# EAGLE design m913-dev-adapter (EAGLE 7.5.1)
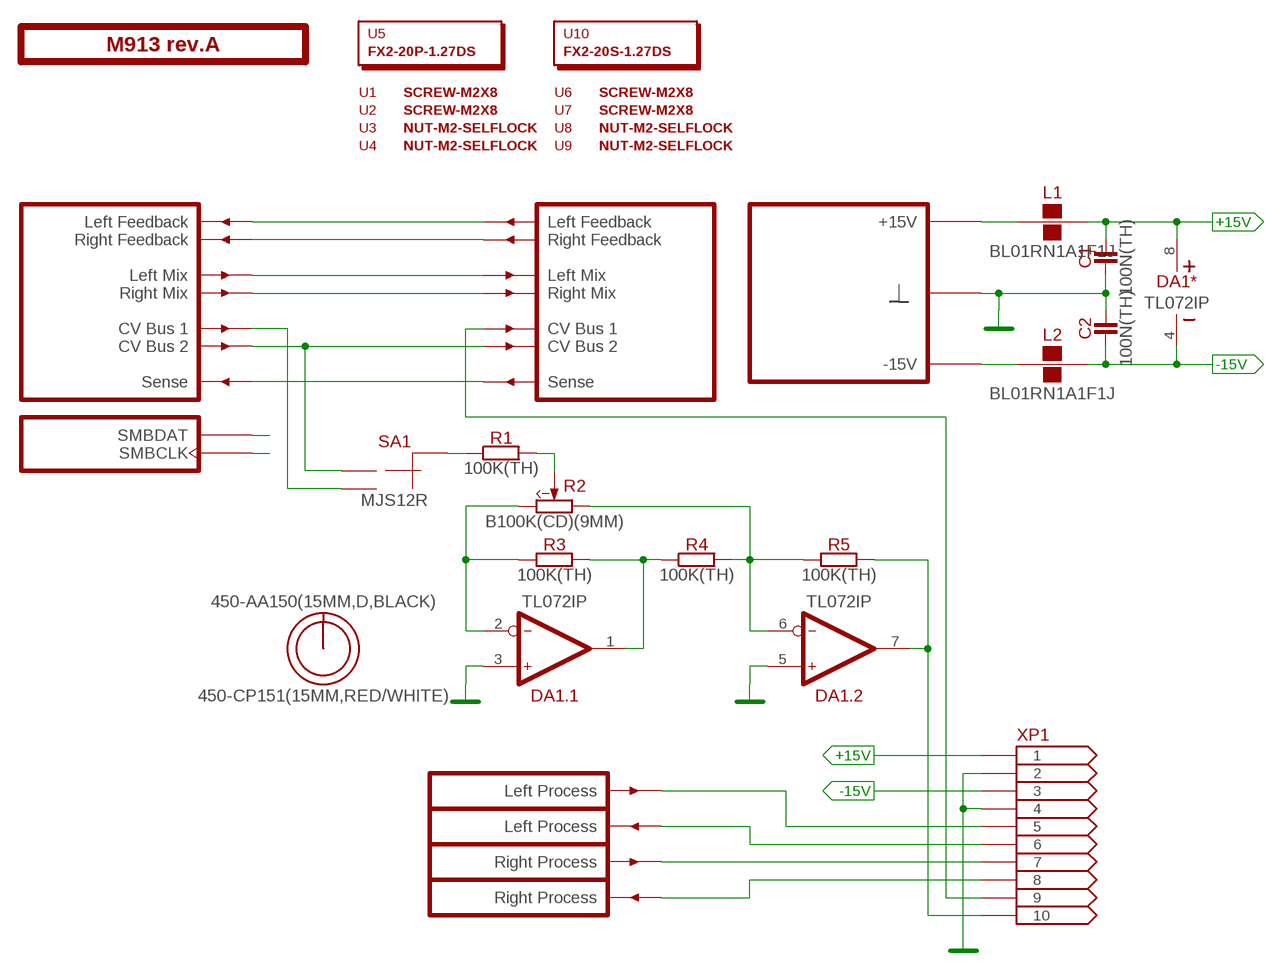
[diagram p0: schematic, sheet 1]

## Parts
C1  100N(TH)  [C050-024X044]
C2  100N(TH)  [C050-024X044]
DA1  TL072IP  [DIP-8]
L1  BL01RN1A1F1J  [BL01RN1A]
L2  BL01RN1A1F1J  [BL01RN1A]
O1  450-AA150(15MM,D,BLACK)  [EMPTY]
O2  450-CP151(15MM,RED/WHITE)  [EMPTY]
PCB1  M913 rev.A  ST2-BOARD-26  [ST2-BOARD-26]
R1  100K(TH)  [R-0207/10]
R2  B100K(CD)(9MM)  [RV09-SINGLE]
R3  100K(TH)  [R-0207/10]
R4  100K(TH)  [R-0207/10]
R5  100K(TH)  [R-0207/10]
SA1  MJS12R  [APEM-MJS12R]
U1  SCREW-M2X8  [EMPTY]
U2  SCREW-M2X8  [EMPTY]
U3  NUT-M2-SELFLOCK  [EMPTY]
U4  NUT-M2-SELFLOCK  [EMPTY]
U5  FX2-20P-1.27DS  [EMPTY]
U6  SCREW-M2X8  [EMPTY]
U7  SCREW-M2X8  [EMPTY]
U8  NUT-M2-SELFLOCK  [EMPTY]
U9  NUT-M2-SELFLOCK  [EMPTY]
U10  FX2-20S-1.27DS  [EMPTY]
XP1  CONN-10-IDC  [ML10]

## Nets
+15V: C1.2 DA1.8(*:V+) L1.2 XP1.1
-15V: C2.1 DA1.4(*:V-) L2.2 XP1.3
GND: C1.1 C2.2 DA1.3(.1:IN+) DA1.5(.2:IN+) PCB1.B4'(GND) PCB1.B4(GND) PCB1.B5'(GND) PCB1.B5(GND) PCB1.B6'(GND) PCB1.B6(GND) PCB1.B7'(GND) PCB1.B7(GND) PCB1.B8'(GND) PCB1.B8(GND) XP1.2 XP1.4
LMIX: PCB1.ALMIX'(LMIX') PCB1.ALMIX(LMIX)
N$1: L1.1 PCB1.A+15'(P+15V) PCB1.A+15(P+15V) PCB1.B+15'(P+15V) PCB1.B+15(P+15V)
N$2: PCB1.ALFBK'(LFBK') PCB1.ALFBK(LFBK)
N$3: R1.2 R2.2(W)
N$4: PCB1.ARFBK'(RFBK') PCB1.ARFBK(RFBK)
N$5: DA1.2(.1:IN-) R2.3(CW) R3.1
N$6: DA1.1(.1:OUT) R3.2 R4.1
N$7: DA1.6(.2:IN-) R2.1(CCW) R4.2 R5.1
N$8: DA1.7(.2:OUT) R5.2 XP1.10
N$9: R1.1 SA1.C(CM)
N$10: PCB1.BINL(INL) XP1.5
N$11: PCB1.BOUTL'(OUTL) XP1.6
N$12: PCB1.BINR(INR) XP1.7
N$13: PCB1.BOUTR'(OUTR) XP1.8
N$14: PCB1.ACV1'(CV1') XP1.9
N$15: PCB1.ACV1(CV1) SA1.NO
N$16: PCB1.BSENSE'(SENSE') PCB1.BSENSE(SENSE)
N$25: L2.1 PCB1.A-15'(P-15V) PCB1.A-15(P-15V) PCB1.B-15'(P-15V) PCB1.B-15(P-15V)
N$38: PCB1.ASMBDAT'(SMBDAT) PCB1.ASMBDAT(SMBDAT)
N$42: PCB1.ACV2'(CV2') PCB1.ACV2(CV2) SA1.NC
N$43: PCB1.ASMBCLK'(SMBCLK) PCB1.ASMBCLK(SMBCLK)
RMIX: PCB1.ARMIX'(RMIX') PCB1.ARMIX(RMIX)

## Library data of the parts
C1 C2 = capacitors:?; MOUSER: 81-RCER71H104K0A2H3B
DA1 = ic-ti:TL072; MOUSER: 595-TL072IP
L1 L2 = inductors:BL01RN1A?; MOUSER: 81-BL01RN1A1F1J
O1 = hardware:450-AA?; MOUSER: 450-AA150
O2 = hardware:450-C?
PCB1 = module-footprints:ST2-BOARD-?
R1 R3-R5 = resistors:?; MOUSER: 71-RN55D-F-100K
R2 = potentiometers:?; MOUSER: 652-PTV09A-4225FB104
SA1 = switches:MJS12R; MOUSER: 642-MJS12R
U1-U4 U6-U9 = hardware:*?
U5 = hardware:?; MOUSER: 798-FX2-20P-1.27DS71
U10 = hardware:?; MOUSER: 798-FX2-20S-1.27DS71
XP1 = connectors:CONN-10-?

## Board
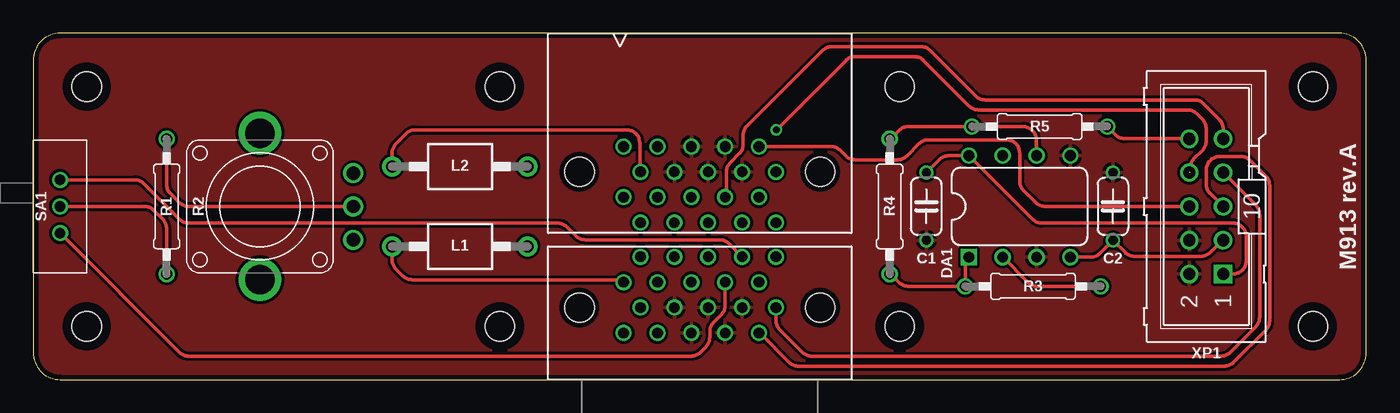
[diagram p1: board, top side]
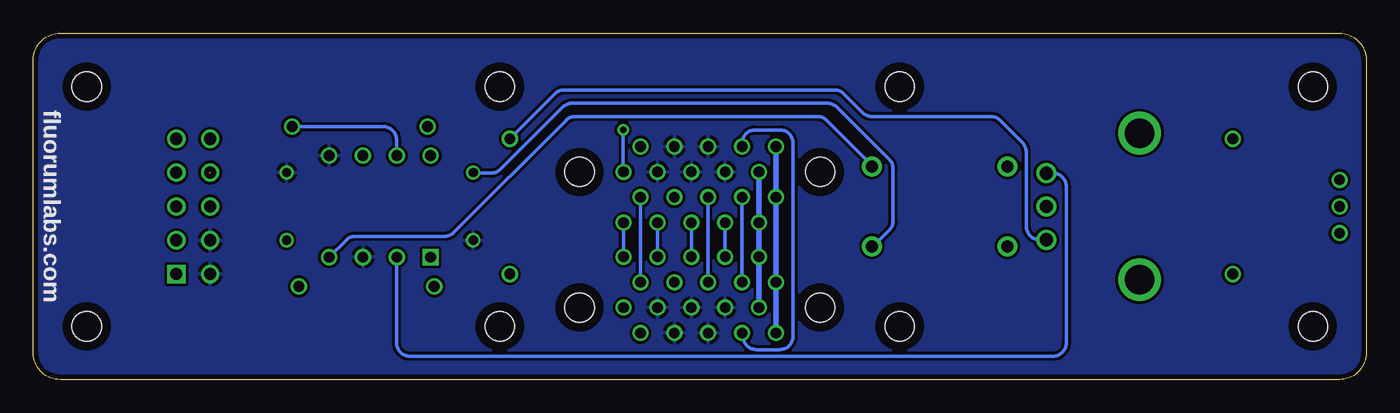
[diagram p2: board, bottom side, seen from below]

Size 100 x 26 mm. Coordinates in mm from the lower left corner, seen from the top.
Outline: 0,24 0,2 arc90 2,0 98,0 arc90 100,2 100,24 arc90 98,26 2,26 arc90 0,24
Copper layers (1*16): Top 0.0356mm / dielectric 1.5011mm / Bottom 0.0356mm
Design rules "sonictrain": minimum track width 6mil, minimum drill 13mil, track to track 8mil, track to pad 8mil, pad to pad 6mil, via to via 6mil, smd to smd 6mil, copper to edge 15mil, drill to drill 6mil, minimum pad ring 7mil, minimum via ring 7mil, stop-mask expansion 3mil, vias tented up to drill 25mil, thermal gap 10mil

### Footprints (pad centres in the part's own frame; a part is rotated, then mirrored left to right if it is on the bottom)
C050-024X044 = drill 0.7: 1 -2.54,0; 2 2.54,0
DIP-8 = drill 0.813 square: 1 -3.81,-3.81 | drill 0.813: 2 -1.27,-3.81; 3 1.27,-3.81; 4 3.81,-3.81; 5 3.81,3.81; 6 1.27,3.81; 7 -1.27,3.81; 8 -3.81,3.81
BL01RN1A = drill 0.9 pad 1.5: 1 -5.08,0; 2 5.08,0
ST2-BOARD-26 = drill 0.8: A+15 44.285,7.31; A+15' 44.285,13.69; A-15 45.555,9.215; A-15' 45.555,11.785; ACV1 51.905,7.31; ACV1' 51.905,13.69; ACV2 53.175,9.215; ACV2' 53.175,11.785; ALFBK 49.365,7.31; ALFBK' 49.365,13.69; ALMIX 46.825,7.31; ALMIX' 46.825,13.69; ARFBK 50.635,9.215; ARFBK' 50.635,11.785; ARMIX 48.095,9.215; ARMIX' 48.095,11.785; ASMBCLK 55.715,9.215; ASMBCLK' 55.715,11.785; ASMBDAT 54.445,7.31; ASMBDAT' 54.445,13.69; B4 48.095,5.405; B4' 48.095,15.595; B5 49.365,3.5; B5' 49.365,17.5; B6 50.635,5.405; B6' 50.635,15.595; B7 51.905,3.5; B7' 51.905,17.5; B8 53.175,5.405; B8' 53.175,15.595; B+15 44.285,3.5; B+15' 44.285,17.5; B-15 45.555,5.405; B-15' 45.555,15.595; BINL 54.445,3.5; BINR 55.715,5.405; BOUTL' 54.445,17.5; BOUTR' 55.715,15.595; BSENSE 46.825,3.5; BSENSE' 46.825,17.5 | hole 2.2: 4,4; 4,22; 96,4; 96,22; 35,22; 65,22; 65,4; 35,4; 59.025,5.405; 40.975,5.405; 40.975,15.595; 59.025,15.595
R-0207/10 = drill 0.813: 1 -5.08,0; 2 5.08,0
RV09-SINGLE = drill 1: 1 -2.5,-7; 2 0,-7; 3 2.5,-7 | drill 2.2: S1 -5.5,0; S2 5.5,0
APEM-MJS12R = drill 0.8: C 0,-2; NC 2,-2; NO -2,-2
ML10 = drill 0.914 square: 1 -5.08,-1.27 | drill 0.914: 2 -5.08,1.27; 3 -2.54,-1.27; 4 -2.54,1.27; 5 0,-1.27; 6 0,1.27; 7 2.54,-1.27; 8 2.54,1.27; 9 5.08,-1.27; 10 5.08,1.27

### Placement (x,y rotation side)
C1  67,13 90 top
C2  81,13 90 top
DA1  74,13 0 top
L1  32,10 0 top
L2  32,16 0 top
O1  -8,-59.25 0 top  (outside the outline)
O2  -9,-60.5 0 top  (outside the outline)
PCB1  0,0 0 top
R1  10,13 90 top
R2  17,13 90 top
R3  75,7 180 top
R4  64.25,13 90 top
R5  75.5,19 0 top
SA1  0,13 90 top
U1  34,-58 0 top  (outside the outline)
U2  37,-58 0 top  (outside the outline)
U3  46,-58 0 top  (outside the outline)
U4  49,-58 0 top  (outside the outline)
U5  28,-58 0 top  (outside the outline)
U6  40,-58 0 top  (outside the outline)
U7  43,-58 0 top  (outside the outline)
U8  52,-58 0 top  (outside the outline)
U9  55,-58 0 top  (outside the outline)
U10  31,-58 0 top  (outside the outline)
XP1  88,13 90 top

### Tracks (layer width: path | path; a pad name or v marks a point on that pad's centre or on a via)
+15V
  Top 0.254: C1.2 67.98,16.52 arc-45 68.68,16.81 DA1.8 74.96,12.04 arc45 75.66,11.75 90,11.75 arc-90 91,10.75 91,8.92 arc-90 90,7.92 XP1.1
  Bottom 0.254: L1.2 37,10 35.79,11.21 arc-45 35.5,11.91 35.5,15.84 arc-45 35.79,16.54 39.71,20.46 arc-45 40.41,20.75 59.59,20.75 arc-45 60.29,20.46 64.96,15.79 arc45 65.66,15.5 66.96,15.5 C1.2
-15V
  Top 0.254: DA1.4 79.32,9.19 arc45 80.02,9.48 C2.1 81.92,9.54 arc45 82.62,9.25 87.59,9.25 arc45 88.29,9.54 89.21,10.46 XP1.3
  Bottom 0.254: L2.2 37.08,16.08 40.46,19.46 arc-45 41.16,19.75 59.34,19.75 arc-45 60.04,19.46 68.46,11.04 arc45 69.16,10.75 75.84,10.75 arc-45 76.54,10.46 DA1.4
GND
  pour Top: 0,26 100,26 100,0 0,0
  pour Bottom: 0,26 100,26 100,0 0,0
LMIX
  Bottom 0.254: PCB1.ALMIX PCB1.ALMIX'
N$1
  Top 0.254: L1.1 26.92,8.99 arc45 27.21,8.29 27.71,7.79 arc45 28.41,7.5 44.09,7.5 PCB1.A+15
  Bottom 0.406: PCB1.B+15' PCB1.A+15' PCB1.A+15 PCB1.B+15
N$2
  Bottom 0.254: PCB1.ALFBK PCB1.ALFBK'
N$3
  Top 0.254: R2.2 11.66,13 arc-45 10.96,13.29 10.29,13.96 arc-45 10,14.66 R1.2
N$4
  Bottom 0.254: PCB1.ARFBK PCB1.ARFBK'
N$5
  Top 0.254: R3.1 75.33,7 arc-45 74.63,7.29 DA1.2
  Bottom 0.254: R2.3 23.5,15.5 arc90 22.5,14.5 22.5,2.75 arc90 23.5,1.75 71.75,1.75 arc90 72.75,2.75 72.75,9.17 DA1.2
N$6
  Top 0.254: DA1.1 arc45 69.92,8.54 R3.2 65.66,7 arc-45 64.96,7.29 64.33,7.92 R4.1
N$7
  Top 0.254: DA1.6 75.25,16.83 75.25,18 arc90 74.25,19 R5.1 65.66,19 arc45 64.96,18.71 64.33,18.08 R4.2
  Bottom 0.254: R2.1 24.5,10.5 arc90 25.5,11.5 25.5,17.09 arc-45 25.79,17.79 27.46,19.46 arc-45 28.16,19.75 37.09,19.75 arc45 37.79,20.04 39.21,21.46 arc-45 39.91,21.75 60.17,21.75 arc-45 60.87,21.46 R4.2
N$8
  Top 0.254: XP1.10 81.91,18.08 arc-45 81.21,18.37 R5.2
  Bottom 0.254: R5.2 73.75,19 arc90 72.75,18 72.75,16.83 DA1.7
N$9
  Top 0.254: SA1.C 8.34,13 arc-45 9.04,12.71 9.71,12.04 arc-45 10,11.34 R1.1
N$10
  Top 0.254: XP1.5 89.25,13 88.29,13.96 arc-45 88,14.66 88,15.75 arc-90 89,16.75 90.59,16.75 arc-45 91.29,16.46 92.46,15.29 arc-45 92.75,14.59 92.75,4.41 arc-45 92.46,3.71 90.04,1.29 arc-45 89.34,1 57.41,1 arc-45 56.71,1.29 54.5,3.5 PCB1.BINL
N$11
  Top 0.254: XP1.6 75.91,13 arc-45 75.21,13.29 74.29,14.21 arc-45 74,14.91 74,17 arc90 73,18 67.16,18 arc45 66.46,17.71 65.54,16.79 arc-45 64.84,16.5 61.66,16.5 arc-45 60.96,16.79 60.54,17.21 arc45 59.84,17.5 PCB1.BOUTL'
N$12
  Top 0.254: PCB1.BINR 55.72,4.45 arc45 56.01,3.74 57.71,2.04 arc45 58.41,1.75 89.09,1.75 arc45 89.79,2.04 91.71,3.96 arc45 92,4.66 92,12.4 arc45 91.71,13.1 XP1.7
N$13  (via drill 0.5)  (1 unrouted)
  Top 0.254: v55.75,18.75 60.96,23.96 arc-45 61.66,24.25 66.09,24.25 arc-45 66.79,23.96 70.21,20.54 arc45 70.91,20.25 86.59,20.25 arc-45 87.29,19.96 87.71,19.54 arc-45 88,18.84 88,17.91 arc-45 87.71,17.21 87.08,16.58 arc45 86.79,15.88 86.79,15.54
  Bottom 0.254: v55.75,18.75 55.75,15.63 PCB1.BOUTR'
N$14
  Top 0.254: XP1.9 89.27,18.82 arc45 88.98,19.52 87.79,20.71 arc45 87.09,21 71.41,21 arc-45 70.71,21.29 67.29,24.71 arc45 66.59,25 59.91,25 arc45 59.21,24.71 53.54,19.04 arc45 53.25,18.34 53.25,17.66 arc-45 52.96,16.96 52.29,16.29 arc45 52,15.59 52,13.79 PCB1.ACV1'
N$15
  Top 0.254: PCB1.ACV1 51.91,5.57 arc-45 51.61,4.86 51.04,4.29 arc45 50.75,3.59 50.75,3.16 arc-45 50.46,2.46 50.04,2.04 arc-45 49.34,1.75 11.66,1.75 arc-45 10.96,2.04 SA1.NO
N$16
  Bottom 0.254: PCB1.BSENSE' 46.83,17.75 arc90 45.83,18.75 44,18.75 arc90 43,17.75 43,3.25 arc90 44,2.25 45.75,2.25 arc90 46.75,3.25 46.75,3.42 PCB1.BSENSE
N$25
  Top 0.254: L2.1 26.92,17.01 arc-45 27.21,17.71 27.96,18.46 arc-45 28.66,18.75 44.5,18.75 arc-90 45.5,17.75 45.5,15.65 PCB1.B-15'
  Bottom 0.406: PCB1.B-15' PCB1.A-15' PCB1.A-15 PCB1.B-15
N$38
  Bottom 0.254: PCB1.ASMBDAT PCB1.ASMBDAT'
N$42
  Top 0.254: SA1.NC 7.59,15 arc-45 8.29,14.71 10.96,12.04 arc45 11.66,11.75 39.34,11.75 arc-45 40.04,11.46 40.71,10.79 arc45 41.41,10.5 51.48,10.5 arc-45 52.18,10.21 PCB1.ACV2
  Bottom 0.254: PCB1.ACV2 PCB1.ACV2'
N$43
  Bottom 0.254: PCB1.ASMBCLK PCB1.ASMBCLK'
RMIX
  Bottom 0.254: PCB1.ARMIX PCB1.ARMIX'